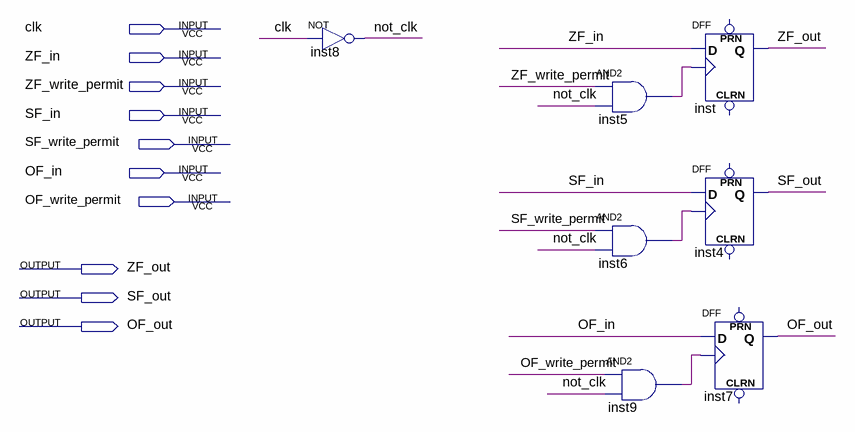
[diagram p0: schematic sheet]
// Quartus schematic flags.bdf as structural Verilog: 7 symbols, 10 pins
module flags (
  input  clk,
  input  ZF_in,
  input  ZF_write_permit,
  input  SF_in,
  input  SF_write_permit,
  input  OF_in,
  input  OF_write_permit,
  output ZF_out,
  output SF_out,
  output OF_out
);

  wire inst5_out, inst6_out, inst9_out, not_clk;

  not inst8 (not_clk, clk);
  and inst5 (inst5_out, ZF_write_permit, not_clk);
  and inst6 (inst6_out, SF_write_permit, not_clk);
  and inst9 (inst9_out, OF_write_permit, not_clk);
  DFF inst (.CLK(inst5_out), .D(ZF_in), .Q(ZF_out));  // open: CLRN, PRN
  DFF inst4 (.CLK(inst6_out), .D(SF_in), .Q(SF_out));  // open: CLRN, PRN
  DFF inst7 (.CLK(inst9_out), .D(OF_in), .Q(OF_out));  // open: CLRN, PRN
endmodule
